# EAGLE schematic MotorShieldTestbench (EAGLE 8.1.0)
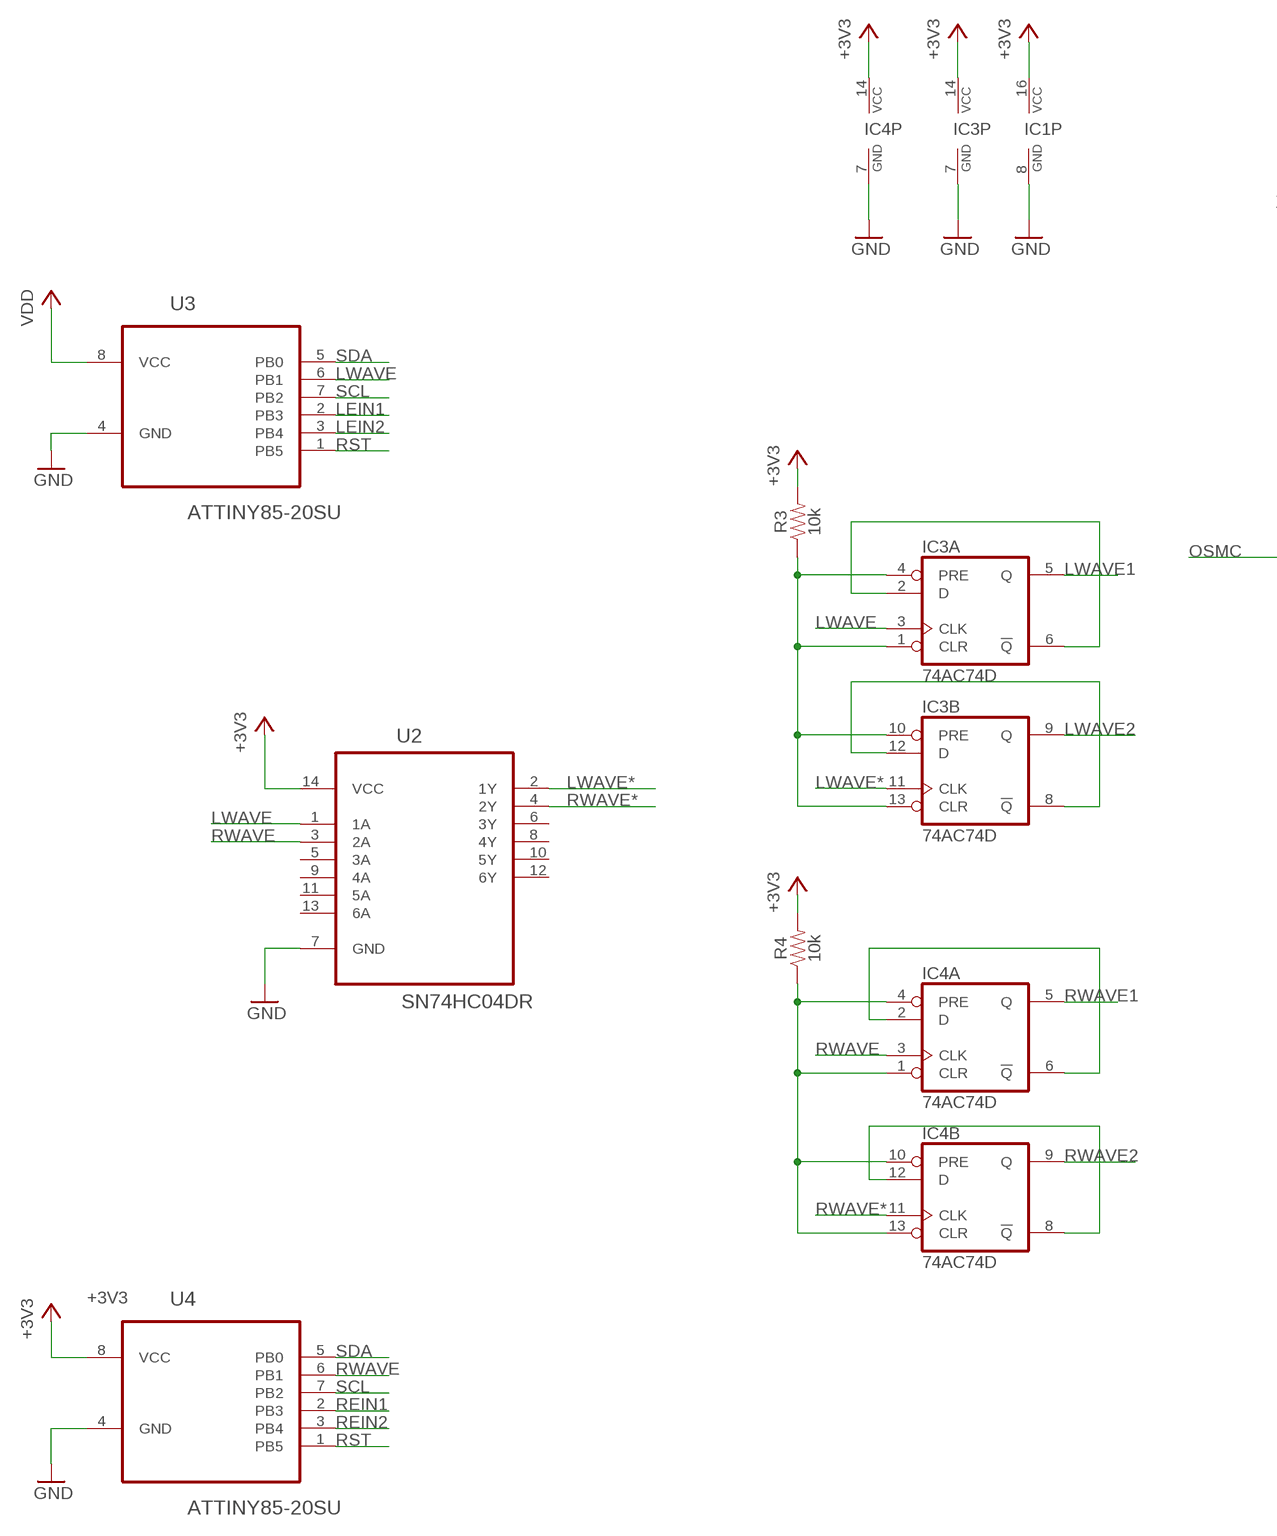
[diagram p0: schematic, sheet 1, part 1 of 2]
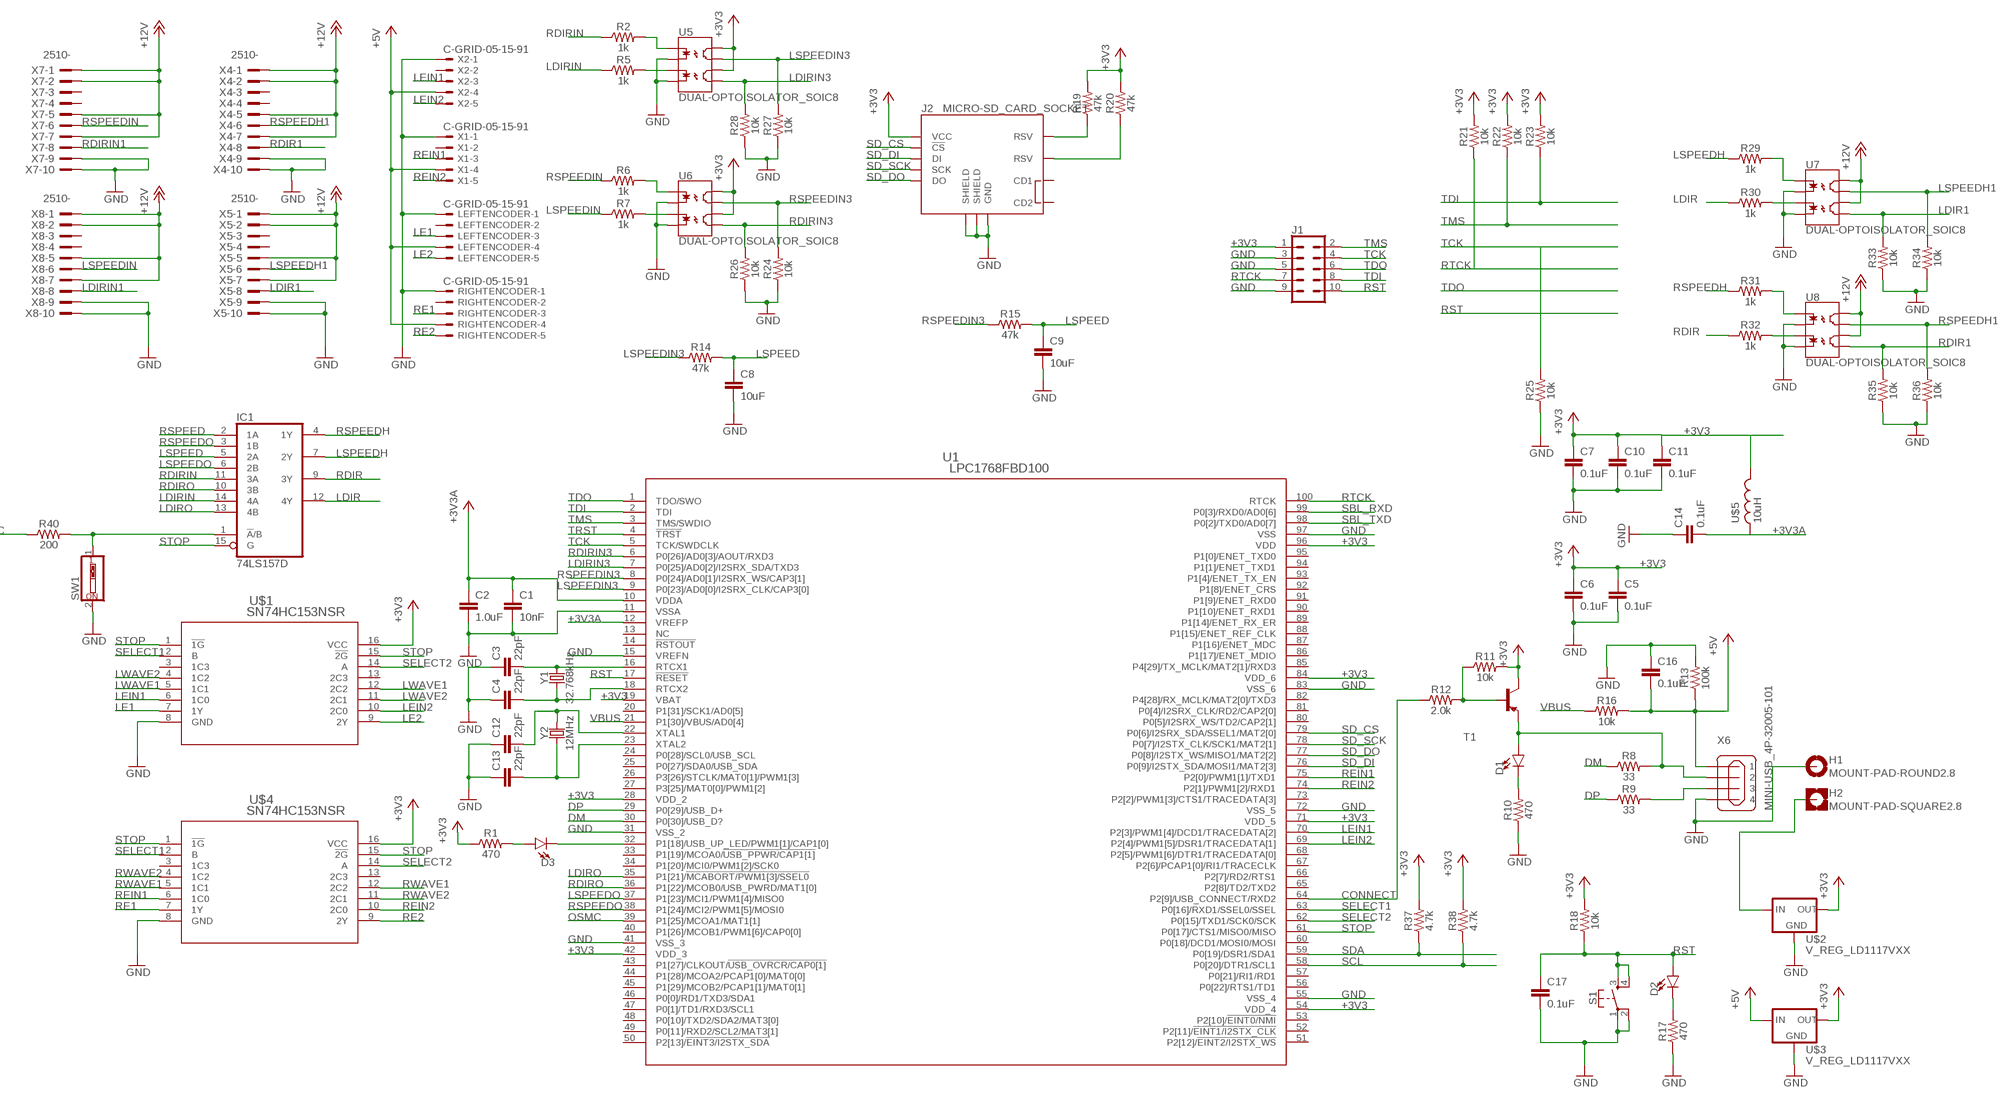
[diagram p1: schematic, sheet 1, part 2 of 2]

## Parts
C1  10nF  10NF-0603-50V-10%  [0603]
C2  1.0uF  1.0UF-0603-16V-10%  [0603]
C3  22pF  22PF-0603-50V-5%  [0603]
C4  22pF  22PF-0603-50V-5%  [0603]
C5  0.1uF  0.1UF-0603-25V-(+80/-20%)  [0603]
C6  0.1uF  0.1UF-0603-25V-(+80/-20%)  [0603]
C7  0.1uF  0.1UF-0603-25V-(+80/-20%)  [0603]
C8  10uF  10UF-0603-6.3V-20%  [0603]
C9  10uF  10UF-0603-6.3V-20%  [0603]
C10  0.1uF  0.1UF-0603-25V-(+80/-20%)  [0603]
C11  0.1uF  0.1UF-0603-25V-(+80/-20%)  [0603]
C12  22pF  22PF-0603-50V-5%  [0603]
C13  22pF  22PF-0603-50V-5%  [0603]
C14  0.1uF  0.1UF-0603-25V-(+80/-20%)  [0603]
C16  0.1uF  0.1UF-0603-25V-(+80/-20%)  [0603]
C17  0.1uF  0.1UF-0603-25V-(+80/-20%)  [0603]
D1  LED0603  [LED-0603]
D2  LED0603  [LED-0603]
D3  LED0603  [LED-0603]
H1  MOUNT-PAD-ROUND2.8  [2,8-PAD]
H2  MOUNT-PAD-SQUARE2.8  [2,8-PAD-SQUARE]
IC1  74LS157D  [SO16]
IC3  74AC74D  [SO14]
IC4  74AC74D  [SO14]
J1  CONN_05X2SHD  [2X5-SHROUDED]
J2  MICRO-SD_CARD_SOCKET  [MICRO-SD-SOCKET]
LEFTENCODER  C-GRID-05-15-91  [15-91-05]
R1  470  470OHM-0603-1/10W-1%  [0603]
R2  1k  1KOHM-0603-1/10W-1%  [0603]
R3  10k  10KOHM-0603-1/10W-1%  [0603]
R4  10k  10KOHM-0603-1/10W-1%  [0603]
R5  1k  1KOHM-0603-1/10W-1%  [0603]
R6  1k  1KOHM-0603-1/10W-1%  [0603]
R7  1k  1KOHM-0603-1/10W-1%  [0603]
R8  33  33OHM-0603-1/10W-1%  [0603]
R9  33  33OHM-0603-1/10W-1%  [0603]
R10  470  470OHM-0603-1/10W-1%  [0603]
R11  10k  10KOHM-0603-1/10W-1%  [0603]
R12  2.0k  2.0KOHM-0603-1/10W-5%  [0603]
R13  100k  100KOHM-0603-1/10W-1%  [0603]
R14  47k  47KOHM-0603-1/10W-1%  [0603]
R15  47k  47KOHM-0603-1/10W-1%  [0603]
R16  10k  10KOHM-0603-1/10W-1%  [0603]
R17  470  470OHM-0603-1/10W-1%  [0603]
R18  10k  10KOHM-0603-1/10W-1%  [0603]
R19  47k  47KOHM-0603-1/10W-1%  [0603]
R20  47k  47KOHM-0603-1/10W-1%  [0603]
R21  10k  10KOHM-0603-1/10W-1%  [0603]
R22  10k  10KOHM-0603-1/10W-1%  [0603]
R23  10k  10KOHM-0603-1/10W-1%  [0603]
R24  10k  10KOHM-0603-1/10W-1%  [0603]
R25  10k  10KOHM-0603-1/10W-1%  [0603]
R26  10k  10KOHM-0603-1/10W-1%  [0603]
R27  10k  10KOHM-0603-1/10W-1%  [0603]
R28  10k  10KOHM-0603-1/10W-1%  [0603]
R29  1k  1KOHM-0603-1/10W-1%  [0603]
R30  1k  1KOHM-0603-1/10W-1%  [0603]
R31  1k  1KOHM-0603-1/10W-1%  [0603]
R32  1k  1KOHM-0603-1/10W-1%  [0603]
R33  10k  10KOHM-0603-1/10W-1%  [0603]
R34  10k  10KOHM-0603-1/10W-1%  [0603]
R35  10k  10KOHM-0603-1/10W-1%  [0603]
R36  10k  10KOHM-0603-1/10W-1%  [0603]
R37  4.7k  4.7KOHM-0603-1/10W-1%  [0603]
R38  4.7k  4.7KOHM-0603-1/10W-1%  [0603]
R40  200  200OHM-0603-1/10W-1%  [0603]
RIGHTENCODER  C-GRID-05-15-91  [15-91-05]
S1  MOMENTARY-SWITCH-SPST-2-SMD-5.2MM  [TACTILE_SWITCH_SMD_5.2MM]
SW1  SW_DIP-1  [EDG-01]
T1  BC856A-PNP-SOT23-BEC  [SOT23-BEC]
U1  LPC1768FBD100  [SOT407-1]
U2  SN74HC04DR  [SOIC127P600X175-14N]
U3  ATTINY85-20SU  [SOIC127P798X216-8N]
U4  ATTINY85-20SU  [SOIC127P798X216-8N]
U5  DUAL-OPTOISOLATOR_SOIC8  [SO08]
U6  DUAL-OPTOISOLATOR_SOIC8  [SO08]
U7  DUAL-OPTOISOLATOR_SOIC8  [SO08]
U8  DUAL-OPTOISOLATOR_SOIC8  [SO08]
U$1  SN74HC153NSR  [NS16]
U$2  V_REG_LD1117VXX  [78XXL]
U$3  V_REG_LD1117VXX  [78XXL]
U$4  SN74HC153NSR  [NS16]
U$5  10uH  MSS1260  [MSS1260]
X1  C-GRID-05-15-91  [15-91-05]
X2  C-GRID-05-15-91  [15-91-05]
X4  2510-  [PAK100/2500-10]
X5  2510-  [PAK100/2500-10]
X6  MINI-USB_4P-32005-101  [32005-101]
X7  2510-  [PAK100/2500-10]
X8  2510-  [PAK100/2500-10]
Y1  32.768kHz  CRYSTAL-32.768KHZSMD-3.2X1.5  [CRYSTAL-SMD-3.2X1.5MM]
Y2  12MHz  CRYSTAL-12MHZ"  [CRYSTAL-SMD-5X3.2-4PAD]

## Nets
+3V3: C5.1 C6.1 C7.1 C10.1 C11.1 J1.1 J2.VCC R1.1 R19.2 R20.2 R21.2 R22.2 R23.2 R37.2 R38.2 U1.19(VBAT) U1.28(VDD_2) U1.42(VDD_3) U1.54(VDD_4) U1.71(VDD_5) U1.84(VDD_6) U1.96(VDD) U3.8(VCC) U4.8(VCC) U5.6(CL2) U5.8(CL1) U6.6(CL2) U6.8(CL1) U$1.16(VCC) U$4.16(VCC) U$5.P$1 ; supply symbol labelled VDD
+3V3A: C1.1 C2.1 C14.2 U1.10(VDDA) U1.12(VREFP) U$5.P$2
+5V: C16.2 LEFTENCODER.4 R13.1 R16.2 RIGHTENCODER.4 U$3.OUT(IN) X1.4 X2.4 X6.1
CONNECT: R12.1 U1.64(P2[9]/USB_CONNECT/RXD2)
DM: R8.1 U1.30(P0[30]/USB_D?)
DP: R9.1 U1.29(P0[29]/USB_D+)
GND: C1.2 C2.2 C3.1 C4.1 C5.2 C6.2 C7.2 C8.2 C9.2 C10.2 C11.2 C12.1 C13.1 C14.1 C16.1 C17.2 H1.B2,8(MOUNT) IC1.8(GND) IC3.7(P:GND) IC4.7(P:GND) J1.3 J1.5 J1.9 J2.GND J2.GND1(SHIELD) J2.GND3(SHIELD) LEFTENCODER.1 R10.1 R13.2 R17.1 R24.1 R25.1 R26.1 R27.1 R28.1 R33.1 R34.1 R35.1 R36.1 RIGHTENCODER.1 S1.1 S1.2 SW1.2 U1.11(VSSA) U1.15(VREFN) U1.31(VSS_2) U1.41(VSS_3) U1.55(VSS_4) U1.72(VSS_5) U1.83(VSS_6) U1.97(VSS) U2.7(GND) U3.4(GND) U4.4(GND) U7.2(C1) U7.4(C2) U8.2(C1) U8.4(C2) U$1.8(GND) U$2.IN(GND) U$3.IN(GND) U$4.8(GND) X1.1 X2.1 X6.4
L+12V: U7.6(CL2) U7.8(CL1) X5.1 X5.2 X5.5 X5.7 X8.1 X8.2 X8.5 X8.7 ; supply symbol labelled +12V
LDIR: IC1.12(4Y) R30.1
LDIR1: R33.2 U7.5(EM2) X5.8
LDIRIN: IC1.14(4A) R5.1
LDIRIN1: X8.8
LDIRIN3: R28.2 U1.7(P0[25]/AD0[2]/I2SRX_SDA/TXD3) U5.5(EM2)
LDIRO: IC1.13(4B) U1.35(P1[21]/!MCABORT/PWM1[3]/SSEL0)
LE1: LEFTENCODER.3 U$1.7(1Y)
LE2: LEFTENCODER.5 U$1.9(2Y)
LEIN1: U1.70(P2[3]/PWM1[4]/DCD1/TRACEDATA[2]) U3.2(PB3) U$1.6(1C0) X2.3
LEIN2: U1.69(P2[4]/PWM1[5]/DSR1/TRACEDATA[1]) U3.3(PB4) U$1.10(2C0) X2.5
LGND: U6.2(C1) U6.4(C2) X5.9 X5.10 X8.9 X8.10 ; supply symbol labelled GND
LSPEED: C8.1 C9.1 IC1.5(2A) R14.2 R15.2
LSPEEDH: IC1.7(2Y) R29.1
LSPEEDH1: R34.2 U7.7(EM1) X5.6
LSPEEDIN: R7.1 X8.6
LSPEEDIN3: R14.1 R27.2 U1.9(P0[23]/AD0[0]/I2SRX_CLK/CAP3[0]) U5.7(EM1)
LSPEEDO: IC1.6(2B) U1.37(P1[23]/MCI1/PWM1[4]/MISO0)
LWAVE: IC3.3(A:CLK) U2.1(1A) U3.6(PB1)
LWAVE1: IC3.5(A:Q) U$1.5(1C1) U$1.12(2C2)
LWAVE2: IC3.9(B:Q) U$1.4(1C2) U$1.11(2C1)
LWAVE*: IC3.11(B:CLK) U2.2(1Y)
N$1: IC3.2(A:D) IC3.6(A:!Q)
N$2: D3.A R1.2
N$3: D3.C U1.32(P1[18]/USB_UP_LED/PWM1[1]/CAP1[0])
N$4: IC3.8(B:!Q) IC3.12(B:D)
N$5: IC4.2(A:D) IC4.6(A:!Q)
N$6: IC4.8(B:!Q) IC4.12(B:D)
N$7: IC1.1(!A!/B) R40.2 SW1.1
N$8: J2.RSV1(RSV) R19.1
N$9: IC4.1(A:CLR) IC4.4(A:PRE) IC4.10(B:PRE) IC4.13(B:CLR) R4.1
N$10: IC3.1(A:CLR) IC3.4(A:PRE) IC3.10(B:PRE) IC3.13(B:CLR) R3.1
N$11: J2.RSV2(RSV) R20.1
N$12: R7.2 U6.3(A2)
N$13: R9.2 X6.3
N$14: R5.2 U5.3(A2)
N$15: C4.2 U1.18(RTCX2) Y1.P$1
N$16: C3.2 U1.16(RTCX1) Y1.P$2
N$17: C13.2 U1.23(XTAL2) Y2.1
N$18: C12.2 U1.22(XTAL1) Y2.3
N$19: R2.2 U5.1(A1)
N$20: D1.A R8.2 T1.E X6.2
N$21: R6.2 U6.1(A1)
N$22: R11.1 R12.2 T1.B
N$23: R29.2 U7.1(A1)
N$24: D1.C R10.2
N$25: R30.2 U7.3(A2)
N$27: D2.C R17.2
N$33: H2.B2,8(MOUNT) U$2.OUT(IN)
N$36: R31.2 U8.1(A1)
N$37: R32.2 U8.3(A2)
OSMC: R40.1 U1.39(P1[25]/MCOA1/MAT1[1])
R+12V: U8.6(CL2) U8.8(CL1) X4.1 X4.2 X4.5 X4.7 X7.1 X7.2 X7.5 X7.7 ; supply symbol labelled +12V
RDIR: IC1.9(3Y) R32.1
RDIR1: R35.2 U8.5(EM2) X4.8
RDIRIN: IC1.11(3A) R2.1
RDIRIN1: X7.8
RDIRIN3: R26.2 U1.6(P0[26]/AD0[3]/AOUT/RXD3) U6.5(EM2)
RDIRO: IC1.10(3B) U1.36(P1[22]/MCOB0/USB_PWRD/MAT1[0])
RE1: RIGHTENCODER.3 U$4.7(1Y)
RE2: RIGHTENCODER.5 U$4.9(2Y)
REIN1: U1.75(P2[0]/PWM1[1]/TXD1) U4.2(PB3) U$4.6(1C0) X1.3
REIN2: U1.74(P2[1]/PWM1[2]/RXD1) U4.3(PB4) U$4.10(2C0) X1.5
RGND: U5.2(C1) U5.4(C2) X4.9 X4.10 X7.9 X7.10 ; supply symbol labelled GND
RSPEED: IC1.2(1A)
RSPEEDH: IC1.4(1Y) R31.1
RSPEEDH1: R36.2 U8.7(EM1) X4.6
RSPEEDIN: R6.1 X7.6
RSPEEDIN3: R15.1 R24.2 U1.8(P0[24]/AD0[1]/I2SRX_WS/CAP3[1]) U6.7(EM1)
RSPEEDO: IC1.3(1B) U1.38(P1[24]/MCI2/PWM1[5]/MOSI0)
RST: C17.1 D2.A J1.10 R18.1 S1.3 S1.4 U1.17(!RESET) U3.1(PB5) U4.1(PB5)
RTCK: J1.7 R21.1 U1.100(RTCK)
RWAVE: IC4.3(A:CLK) U2.3(2A) U4.6(PB1)
RWAVE1: IC4.5(A:Q) U$4.5(1C1) U$4.12(2C2)
RWAVE2: IC4.9(B:Q) U$4.4(1C2) U$4.11(2C1)
RWAVE*: IC4.11(B:CLK) U2.4(2Y)
SBL_RXD: U1.99(P0[3]/RXD0/AD0[6])
SBL_TXD: U1.98(P0[2]/TXD0/AD0[7])
SCL: R38.1 U1.58(P0[20]/DTR1/SCL1) U3.7(PB2) U4.7(PB2)
SD_CS: J2.CS(!CS) U1.79(P0[6]/I2SRX_SDA/SSEL1/MAT2[0])
SD_DI: J2.DI U1.76(P0[9]/I2STX_SDA/MOSI1/MAT2[3])
SD_DO: J2.DO U1.77(P0[8]/I2STX_WS/MISO1/MAT2[2])
SD_SCK: J2.SCLK(SCK) U1.78(P0[7]/I2STX_CLK/SCK1/MAT2[1])
SDA: R37.1 U1.59(P0[19]/DSR1/SDA1) U3.5(PB0) U4.5(PB0)
SELECT1: U1.63(P0[16]/RXD1/SSEL0/SSEL) U$1.2(B) U$4.2(B)
SELECT2: U1.62(P0[15]/TXD1/SCK0/SCK) U$1.14(A) U$4.14(A)
STOP: IC1.15(G) U1.61(P0[17]/CTS1/MISO0/MISO) U$1.1(!1G) U$1.15(!2G) U$4.1(!1G) U$4.15(!2G)
TCK: J1.4 R25.2 U1.5(TCK/SWDCLK)
TDI: J1.8 R23.1 U1.2(TDI)
TDO: J1.6 U1.1(TDO/SWO)
TMS: J1.2 R22.1 U1.3(TMS/SWDIO)
TRST: U1.4(!TRST)
VBUS: R16.1 U1.21(P1[30]/VBUS/AD0[4])
VDD: IC1.16(VCC) IC3.14(P:VCC) IC4.14(P:VCC) R3.2 R4.2 R11.2 R18.2 T1.C U2.14(VCC) U$2.GND(OUT) U$3.GND(OUT) ; supply symbol labelled +3V3
Unconnected: J2.CD1 J2.CD2 LEFTENCODER.2 RIGHTENCODER.2 U1.13(NC) U1.14(!RSTOUT) U1.20(P1[31]/SCK1/AD0[5]) U1.24(P0[28]/SCL0/USB_SCL) U1.25(P0[27]/SDA0/USB_SDA) U1.26(P3[26]/STCLK/MAT0[1]/PWM1[3]) U1.27(P3[25]/MAT0[0]/PWM1[2]) U1.33(P1[19]/MCOA0/!USB_PPWR/CAP1[1]) U1.34(P1[20]/MCI0/PWM1[2]/SCK0) U1.40(P1[26]/MCOB1/PWM1[6]/CAP0[0]) U1.43(P1[27]/CLKOUT/!USB_OVRCR/CAP0[1]) U1.44(P1[28]/MCOA2/PCAP1[0]/MAT0[0]) U1.45(P1[29]/MCOB2/PCAP1[1]/MAT0[1]) U1.46(P0[0]/RD1/TXD3/SDA1) U1.47(P0[1]/TD1/RXD3/SCL1) U1.48(P0[10]/TXD2/SDA2/MAT3[0]) U1.49(P0[11]/RXD2/SCL2/MAT3[1]) U1.50(P2[13]/!EINT3/I2STX_SDA) U1.51(P2[12]/!EINT2/I2STX_WS) U1.52(P2[11]/!EINT1/I2STX_CLK) U1.53(P2[10]/!EINT0/NMI) U1.56(P0[22]/RTS1/TD1) U1.57(P0[21]/RI1/RD1) U1.60(P0[18]/DCD1/MOSI0/MOSI) U1.65(P2[8]/TD2/TXD2) U1.66(P2[7]/RD2/RTS1) U1.67(P2[6]/PCAP1[0]/RI1/TRACECLK) U1.68(P2[5]/PWM1[6]/DTR1/TRACEDATA[0]) U1.73(P2[2]/PWM1[3]/CTS1/TRACEDATA[3]) U1.80(P0[5]/I2SRX_WS/TD2/CAP2[1]) U1.81(P0[4]/I2SRX_CLK/RD2/CAP2[0]) U1.82(P4[28]/RX_MCLK/MAT2[0]/TXD3) U1.85(P4[29]/TX_MCLK/MAT2[1]/RXD3) U1.86(P1[17]/ENET_MDIO) U1.87(P1[16]/ENET_MDC) U1.88(P1[15]/ENET_REF_CLK) U1.89(P1[14]/ENET_RX_ER) U1.90(P1[10]/ENET_RXD1) U1.91(P1[9]/ENET_RXD0) U1.92(P1[8]/ENET_CRS) U1.93(P1[4]/ENET_TX_EN) U1.94(P1[1]/ENET_TXD1) U1.95(P1[0]/ENET_TXD0) U2.5(3A) U2.6(3Y) U2.8(4Y) U2.9(4A) U2.10(5Y) U2.11(5A) U2.12(6Y) U2.13(6A) U$1.3(1C3) U$1.13(2C3) U$4.3(1C3) U$4.13(2C3) X1.2 X2.2 X4.3 X4.4 X5.3 X5.4 X7.3 X7.4 X8.3 X8.4

## Library data of the parts
C1 = SparkFun-Capacitors:10NF: 0.01uF/10nF/10,000pF ceramic capacitors A capacitor is a passive two-terminal electrical component used to store electrical energy temporarily in an electric field. CAP-09321; PROD_ID: CAP-00867
C2 = SparkFun-Capacitors:1.0UF: 1µF ceramic capacitors A capacitor is a passive two-terminal electrical component used to store electrical energy temporarily in an electric field.; PROD_ID: CAP-00868
C3 C4 C12 C13 = SparkFun-Capacitors:22PF: 22pF ceramic capacitors A capacitor is a passive two-terminal electrical component used to store electrical energy temporarily in an electric field.; PROD_ID: CAP-07876
C5-C7 C10 C11 C14 C16 C17 = SparkFun-Capacitors:0.1UF: 0.1µF ceramic capacitors A capacitor is a passive two-terminal electrical component used to store electrical energy temporarily in an electric field.; PROD_ID: CAP-00810
C8 C9 = SparkFun-Capacitors:10UF: 10.0µF ceramic capacitors A capacitor is a passive two-terminal electrical component used to store electrical energy temporarily in an electric field.; PROD_ID: CAP-11015
D1-D3 = SparkFun-LED:LED: LED (Generic) Standard schematic elements and footprints for 5mm, 3mm, 1206, and 0603 sized LEDs. Generic LEDs with no color specified.
H1 = holes:MOUNT-PAD-ROUND: MOUNTING PAD, round
H2 = holes:MOUNT-PAD-SQUARE: MOUNTING PAD, square
IC1 = 74xx-eu:74*157: Quadruple 2-line to 1-line data SELECTOR/MULTIPLEXER
IC3 IC4 = 74xx-eu:74*74: Dual D type positive edge triggered FLIP FLOP, preset and clear
J1 = SparkFun-Connectors:CONN_05X2: Multi connection point. Often used as Generic Header-pin footprint for 0.1 inch spaced/style header connections For AVR SPI programming port, see special device with nice symbol: "AVR_SPI_PROG_5x2.dev" You can populate with any combo of single row headers, but if you'd like an exact match, check these: 2x5 AVR ICSP Male Header <https://www.sparkfun.com/products/778> (PRT-00778) 2x5 Pin Shrouded Header <https://www.sparkfun.com/products/8506> (PRT-08506) On any of the 0.1 inch spaced packages, you can populate with these: Break Away Headers - Straight <https://www.sparkfun.com/products/116> (PRT-00116) Break Away Male Headers - Right Angle <https://www.sparkfun.com/products/553> (PRT-00553) Female Headers <https://www.sparkfun.com/products/115> (PRT-00115) Break Away Headers - Machine Pin <https://www.sparkfun.com/products/117> (PRT-00117) Break Away Female Headers - Swiss Machine Pin <https://www.sparkfun.com/products/743> (PRT-00743) Special note: the shrouded connector mates well with our 5x2 ribbon cables: 2x5 Pin IDC Ribbon Cable <https://www.sparkfun.com/products/8535> (PRT-08535); PROD_ID: CONN-08671; SF_ID: PRT-08506
J2 = SparkFun-Connectors:MICRO-SD_CARD_SOCKET: microSD Socket for Transflash Push-push type µSD socket. tDoc lines correctly indicate media card edge positions when inserting (unlocked, locked, depressed). NOTE: CD1 and CD2 are connected internally, and the default detect state of the socket is detect pin to ground. SparkFun Products: WAV Trigger <https://www.sparkfun.com/products/13660> CAN-Bus Shield <https://www.sparkfun.com/products/13262> SparkFun Level Shifing microSD Breakout <https://www.sparkfun.com/products/13743>; PROD_ID: CONN-07820; SF_ID: PRT-00127
LEFTENCODER RIGHTENCODER X1 X2 = con-molex:C-GRID-05: CONNECTOR wire to board 2.54 mm (0.100") pitch header; OC_FARNELL: unknown; OC_NEWARK: unknown
R1 R10 R17 = SparkFun-Resistors:470OHM: 470Ω resistor A resistor is a passive two-terminal electrical component that implements electrical resistance as a circuit element. Resistors act to reduce current flow, and, at the same time, act to lower voltage levels within circuits. - Wikipedia; PROD_ID: RES-07869
R2 R5-R7 R29-R32 = SparkFun-Resistors:1KOHM: 1kΩ resistor A resistor is a passive two-terminal electrical component that implements electrical resistance as a circuit element. Resistors act to reduce current flow, and, at the same time, act to lower voltage levels within circuits. - Wikipedia; PROD_ID: RES-07856
R3 R4 R11 R16 R18 R21-R28 R33-R36 = SparkFun-Resistors:10KOHM: 10kΩ resistor A resistor is a passive two-terminal electrical component that implements electrical resistance as a circuit element. Resistors act to reduce current flow, and, at the same time, act to lower voltage levels within circuits. - Wikipedia; PROD_ID: RES-00824
R8 R9 = SparkFun-Resistors:33OHM: 33Ω resistor A resistor is a passive two-terminal electrical component that implements electrical resistance as a circuit element. Resistors act to reduce current flow, and, at the same time, act to lower voltage levels within circuits. - Wikipedia; PROD_ID: RES-08270
R12 = SparkFun-Resistors:2.0KOHM: 2kΩ resistor A resistor is a passive two-terminal electrical component that implements electrical resistance as a circuit element. Resistors act to reduce current flow, and, at the same time, act to lower voltage levels within circuits. - Wikipedia; PROD_ID: RES-08296
R13 = SparkFun-Resistors:100KOHM: 100kΩ resistor A resistor is a passive two-terminal electrical component that implements electrical resistance as a circuit element. Resistors act to reduce current flow, and, at the same time, act to lower voltage levels within circuits. - Wikipedia; PROD_ID: RES-07828
R14 R15 R19 R20 = SparkFun-Resistors:47KOHM: 47kΩ resistor A resistor is a passive two-terminal electrical component that implements electrical resistance as a circuit element. Resistors act to reduce current flow, and, at the same time, act to lower voltage levels within circuits. - Wikipedia; PROD_ID: RES-07871
R37 R38 = SparkFun-Resistors:4.7KOHM: 4.7kΩ resistor A resistor is a passive two-terminal electrical component that implements electrical resistance as a circuit element. Resistors act to reduce current flow, and, at the same time, act to lower voltage levels within circuits. - Wikipedia; PROD_ID: RES-07857
R40 = SparkFun-Resistors:200OHM: 200Ω resistor A resistor is a passive two-terminal electrical component that implements electrical resistance as a circuit element. Resistors act to reduce current flow, and, at the same time, act to lower voltage levels within circuits. - Wikipedia; PROD_ID: RES-08220
S1 = SparkFun-Switches:MOMENTARY-SWITCH-SPST-2: Momentary Switch (Pushbutton) - SPST - Two Circuits Normally-open (NO) SPST momentary switches (buttons, pushbuttons). Schematic symbol includes two switch circuits. Variants SMD-4.6MMX2.8MM - 4.60mm x 2.80mm Tactile Momentary Button Switch - Used on SparkFun SAMD21 Mini Breakout <https://www.sparkfun.com/products/13664> SMD-5.2MM - Mini Pushbutton Switch - SMD <https://www.sparkfun.com/products/8720> - Used on Arduino Pro Mini <https://www.sparkfun.com/products/11114>; PROD_ID: SWCH-08247; SF_SKU: COM-08720
SW1 = special:SW_DIP-1: DIP SWITCH
T1 = transistor:*-PNP-: PNP Transistror
U1 = DigiKey:LPC1768FBD100; MANUFACTURER_PART_NUMBER: lpc1768fbd100; VENDOR: NXP
U2 = Texas Instruments_By_element14_Batch_1:SN74HC04DR: HEX INVERTERS; MPN: SN74HC04DR; OC_FARNELL: 1311424; OC_NEWARK: 67K2839; PACKAGE: SOIC-14; SUPPLIER: Texas Instruments
U3 U4 = Atmel_By_element14_Batch_1-00:ATTINY85-20SU: 8-bit Microcontroller with In-System Programmable Flash; MPN: ATTINY85-20SU; OC_FARNELL: 1455164; OC_NEWARK: 58M3797; PACKAGE: SOIC-8; SUPPLIER: Atmel
U5-U8 = SparkFun-DiscreteSemi:DUAL-OPTOISOLATOR: Optocoupler, Phototransistor Output, Dual Channel Optically coupled pairs with a gallium arsenide infrared LED and a silicon NPN phototransistor. Signal information, including a DC level, can be transmitted by the device while maintaining a high degree of electrical isolation between input and output. Datasheet <https://www.sparkfun.com/datasheets/Components/SMD/ild205t.pdf> SparkFun Products: SparkFun Opto-isolator Breakout <https://www.sparkfun.com/products/9118>; PROD_ID: IC-09076
U$1 U$4 = DigiKey:SN74HC153NSR; MANUFACTURER_PART_NUMBER: SN74HC153NSR; VENDOR: Vendor
U$2 U$3 = SparkFun-IC-Power:V_REG_LD1117VXX: LD1117VXX voltage regulator. We carry the 3.3V version (COM-00526) in TO-220 package.
U$5 = inductor-coilcraft:MSS1260: SMT Power Inductor
X4 X5 X7 X8 = con-3m:2510-: 3M (TM) Pak 100 4-Wall Header Source: 3M; MF: 3M; MPN: 2510-6002UB; OC_FARNELL: 9838244; OC_NEWARK: 46F4725
X6 = con-cypressindustries:MINI-USB_4P-: MINI USB 4 Pol. Source: www.cypressindustries.com; OC_FARNELL: unknown; OC_NEWARK: unknown
Y1 = SparkFun-Clocks:CRYSTAL-32.768KHZ: 32.768kHz Crystal Frequency: 32.768kHz Frequency Stability: ±20ppm Load Capacitance: 12.5pF (PTH-2X6 & SMD-3.2X1.5), 6pF (SMD-2X6) SparkFun Products: SparkFun BigTime Watch Kit <https://www.sparkfun.com/products/11734> SparkFun nRF52832 Breakout <https://www.sparkfun.com/products/13990> SparkFun Real Time Clock Module <https://www.sparkfun.com/products/12708>; PROD_ID: XTAL-13062
Y2 = SparkFun-Clocks:CRYSTAL-12MHZ: 12.0MHz Crystal Frequency: 12.0MHz Frequency Tolerance: ±20ppm Load Capacitance: 18pF SparkFun Products: SparkFun Logomatic <https://www.sparkfun.com/products/12772> Pocket AVR Programmer <https://www.sparkfun.com/products/9825>; PROD_ID: XTAL-08297